# Altium project PCB_Project1.PrjPCB
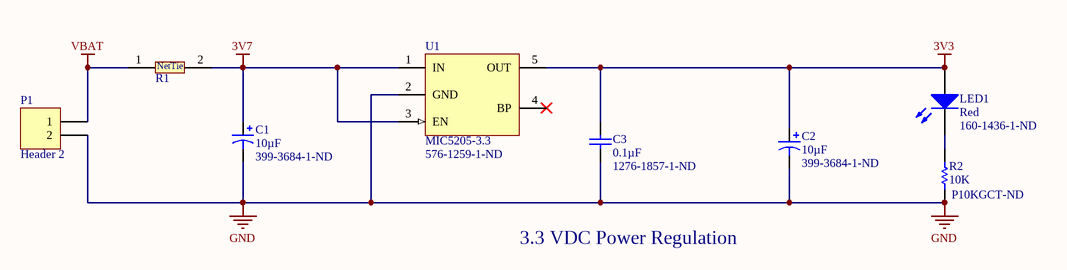
[diagram p0: Sheet1.SchDoc]
1 sheet, 8 parts. Net scope: global (net labels, ports and power ports of the same name join across sheets).
Board file: PCB1.PcbDoc

## Sheet Sheet1.SchDoc
size A

### Parts
C1  10µF  Supplier Part Number 1: 399-3684-1-ND  [CAPC3216_L]
C2  10µF  Supplier Part Number 1: 399-3684-1-ND  [CAPC3216_L]
C3  0.1µF  Supplier Part Number 1: 1276-1857-1-ND  [CAPC0603_L]
LED1  Red  Supplier Part Number 1: 160-1436-1-ND  [0603_A]
P1  Header 2  [HDR1X2]
R1  NetTie  [NetTie]  (value not drawn)  (net tie, no BOM)
R2  10K  Supplier Part Number 1: P10KGCT-ND  [RESC0603_L]
U1  MIC5205-3.3  Supplier Part Number 1: 576-1259-1-ND  [SOT-23-OT5_L]

### Nets
3V3: C2.1 C3.2 LED1.2(A) U1.5(OUT)
3V7: C1.1 R1.2 U1.1(IN) U1.3(EN)
GND: C1.2 C2.2 C3.1 P1.2 R2.1 U1.2(GND)
VBAT: P1.1 R1.1
NetLED1_1: LED1.1(K) R2.2

Not connected (* = marked no-connect by the designer): U1 4(BP)*

### Notes on the sheet
- 3.3 VDC Power Regulation

### Library data of the parts
C1 C2 = CAP_10uF: CAP TANT 10UF 10V 10% 1206; Manufacturer: Kemet; Manufacturer Part Number: T491A106K010AT; Manufacturer Size Code: A; ESR (Equivalent Series Resistance): 3.8 Ohm; Type: Molded; Lifetime @ Temp.: 2000 Hrs @ 85°C; ComponentLink1URL: http://www.kemet.com/Lists/ProductCatalog/Attachments/254/KEM_T2005_T491.pdf; Capacitance: 10µF; Tolerance: ±10%; ComponentLink1Description: http://www.kemet.com/Lists/ProductCatalog/Attachments/254/KEM_T2005_T491.pdf; Supplier 1: Digi-Key; RoHS: RoHS Compliant; Category: Capacitors; Stock 1: 578846; Pricing 1: 1=0.38, 10=0.337, 50=0.2044, 100=0.1684, 250=0.13468, 500=0.12266, 1000=0.11063 (USD); Packaging: Cut Tape (CT); Voltage - Rated: 10V; Operating Temperature: -55°C ~ 125°C; Mounting Type: Surface Mount; Package / Case: 1206 (3216 Metric); Size / Dimension: 0.126" L x 0.063" W (3.20mm x 1.60mm); Height - Seated (Max): 0.071" (1.80mm); Lead Spacing: -; Features: General Purpose
C3 = CAP_100nF: CAP CER 0.1UF 25V 10% X5R 0603; Manufacturer: Samsung Electro-Mechanics America, Inc; Manufacturer Part Number: CL10A104KA8NNNC; Tolerance: ±10%; Supplier 1: Digi-Key; RoHS: RoHS Compliant; Category: Capacitors; Stock 1: 17485; Pricing 1: 1=0.1, 10=0.036, 25=0.0256, 100=0.0165, 500=0.01156, 1000=0.009 (USD); Packaging: Cut Tape (CT); Capacitance: 0.1µF; Voltage - Rated: 25V; Temperature Coefficient: X5R; Mounting Type: Surface Mount, MLCC; Operating Temperature: -55°C ~ 85°C; Applications: General Purpose; Ratings: -; Package / Case: 0603 (1608 Metric); Size / Dimension: 0.063" L x 0.031" W (1.60mm x 0.80mm); Height - Seated (Max): -; Thickness (Max): 0.035" (0.90mm); Lead Spacing: -; Features: -; Lead Style: -; ComponentLink1URL: http://www.samsungsem.com/global/support/library/product-catalog/__icsFiles/afieldfile/2014/11/13/MLCC.pdf; ComponentLink1Description: http://www.samsungsem.com/global/support/library/product-catalog/__icsFiles/afieldfile/2014/11/13/MLCC.pdf
LED1 = LED_RED_0603: SMD mono-color Chip LED, Red; Manufacturer: Lite-On Inc; Manufacturer Part Number: LTST-C190KRKT; Wavelength - Dominant: 631nm; Wavelength - Peak: 639nm; Millicandela Rating: 99mcd; Voltage - Forward (Vf) (Typ): 2V; Current - Test: 20mA; Viewing Angle: 130°; Lens Transparency: Clear; Lens Color: Colorless; Lens Style/Size: Rectangle with Flat Top, 1.10mm x 0.80mm; Color: Red; ComponentLink1URL: http://optoelectronics.liteon.com/upload/download/DS-22-99-0151/S_110_LTST-C190KRKT.pdf; ComponentLink1Description: http://optoelectronics.liteon.com/upload/download/DS-22-99-0151/S_110_LTST-C190KRKT.pdf; Supplier 1: Digi-Key; RoHS: RoHS Compliant; Category: Optoelectronics; Stock 1: 295836; Pricing 1: 1=0.28, 10=0.218, 100=0.1188, 250=0.0792, 500=0.06732, 1000=0.05148 (USD); Packaging: Cut Tape (CT); Package / Case: 0603 (1608 Metric); Supplier Device Package: *; Size / Dimension: 1.60mm L x 0.80mm W; Height (Max): 0.80mm; Mounting Type: Surface Mount
P1 = Header 2: Header, 2-Pin; LatestRevisionDate: 17-Jul-2002; LatestRevisionNote: Re-released for DXP Platform.; Publisher: Altium Limited
R1 = NetTie: Used to bridge two uniquely named Nets together
R2 = RES_10K: RES SMD 10K OHM 5% 1/10W 0603; Manufacturer: Panasonic Electronic Components; Manufacturer Part Number: ERJ-3GEYJ103V; Case-EIA: 0603; Power: 0.1 W; Value: 10000.00 Ohm; Case-Metric: 1608; Power (Watts): 0.1W, 1/10W; Temperature Coefficient: ±200ppm/°C; Technology: SMT; Tolerance: 5 %; Supplier 1: Digi-Key; RoHS: RoHS Compliant; Category: Resistors; Stock 1: 4017868; Pricing 1: 1=0.1, 50=0.0096, 100=0.0071, 250=0.00544, 500=0.00436, 1000=0.00321 (USD); Packaging: Cut Tape (CT); Resistance (Ohms): 10k; Composition: Thick Film; Features: Automotive AEC-Q200; Operating Temperature: -55°C ~ 155°C; Package / Case: 0603 (1608 Metric); Supplier Device Package: 0603; Size / Dimension: 0.063" L x 0.031" W (1.60mm x 0.80mm); Height: 0.022" (0.55mm); Number of Terminations: 2; ComponentLink1URL: http://industrial.panasonic.com/www-cgi/jvcr13pz.cgi?E+PZ+3+AOA0001+ERJ3GEYJ103V+7+WW; ComponentLink1Description: http://industrial.panasonic.com/www-cgi/jvcr13pz.cgi?E+PZ+3+AOA0001+ERJ3GEYJ103V+7+WW
U1 = MIC5205: Voltage Regulator 3.3V; Manufacturer: Microchip Technology; Manufacturer Part Number: MIC5205-3.3YM5-TR; Regulator Topology: Positive Fixed; Current - Output: 150mA; Voltage - Dropout (Typical): 0.165V @ 150mA; Number of Regulators: 1; Voltage - Input: Up to 16V; Supplier 1: Digi-Key; RoHS: RoHS Compliant; Category: Integrated Circuits (ICs); Stock 1: 20178; Pricing 1: 1=0.4, 25=0.33, 100=0.3 (USD); Packaging: Cut Tape (CT); Voltage - Output: 3.3V; Current - Limit (Min): -; Operating Temperature: -40°C ~ 125°C; Mounting Type: Surface Mount; Package / Case: SC-74A, SOT-753; Supplier Device Package: SOT-23-5; ComponentLink1URL: http://www.microchip.com/mymicrochip/filehandler.aspx?ddocname=en579613; ComponentLink1Description: http://www.microchip.com/mymicrochip/filehandler.aspx?ddocname=en579613